# EAGLE design CoolRoof Terminal Module alimentation (EAGLE 9.5.2)
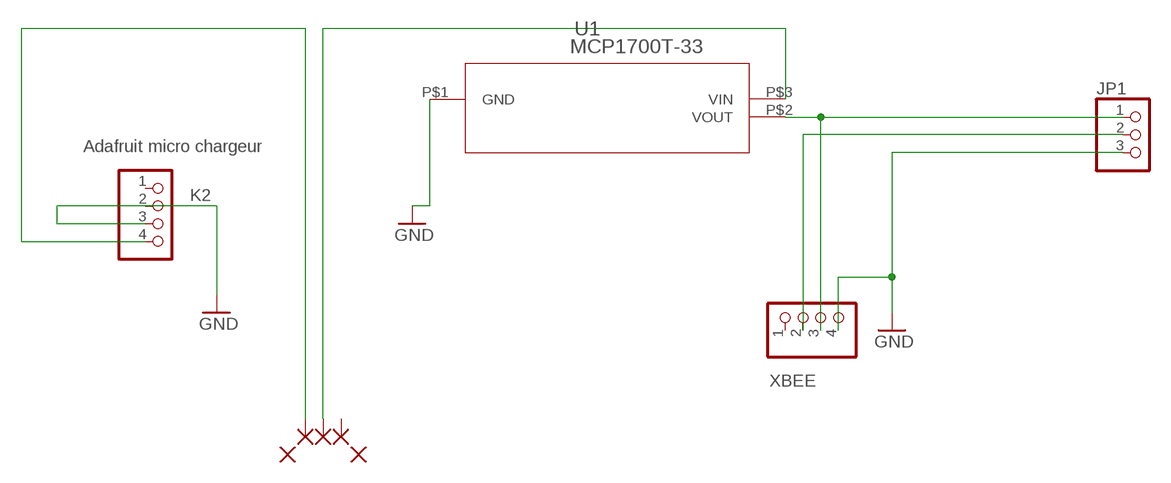
[diagram p0: schematic, sheet 1]

## Parts
JP1  PINHD-1X3  [1X03]
K2  Adafruit micro chargeur  PINHD-1X4  [1X04]
PAD1  1,6/0,8  [1,6/0,8]
PAD2  1,6/0,8  [1,6/0,8]
PAD3  1,6/0,8  [1,6/0,8]
PAD4  N_2,0/1,5  [2,0/1,5]
PAD5  N_2,0/1,5  [2,0/1,5]
U1  MCP1700T-33  MCP1700T-3302E/TTSOT-23  [SOT-23]
XBEE  PINHD-1X4  [1X04]

## Nets
GND: JP1.3 K2.2 K2.3 U1.P$1(GND) XBEE.4
N$1: JP1.1 U1.P$2(VOUT) XBEE.3
N$2: JP1.2 XBEE.2
N$3: K2.4 PAD1.1(P)
N$8: PAD2.1(P) U1.P$3(VIN)
Unconnected: K2.1 PAD3.1(P) XBEE.1

## Library data of the parts
JP1 = pinhead:PINHD-1X3: PIN HEADER
K2 = pinhead:PINHD-1X4: PIN HEADER
PAD1-PAD3 = _MCL_PADS:1,6/0,8
PAD4 PAD5 = _MCL_PADS:N_2,0/1,5
U1 = MCP1700T-3302E:MCP1700T-3302E/TT
XBEE = _MCL_pinhead:PINHD-1X4: PIN HEADER

## Net classes
0 default: width 0.508 mm, clearance 0.508 mm

## Board
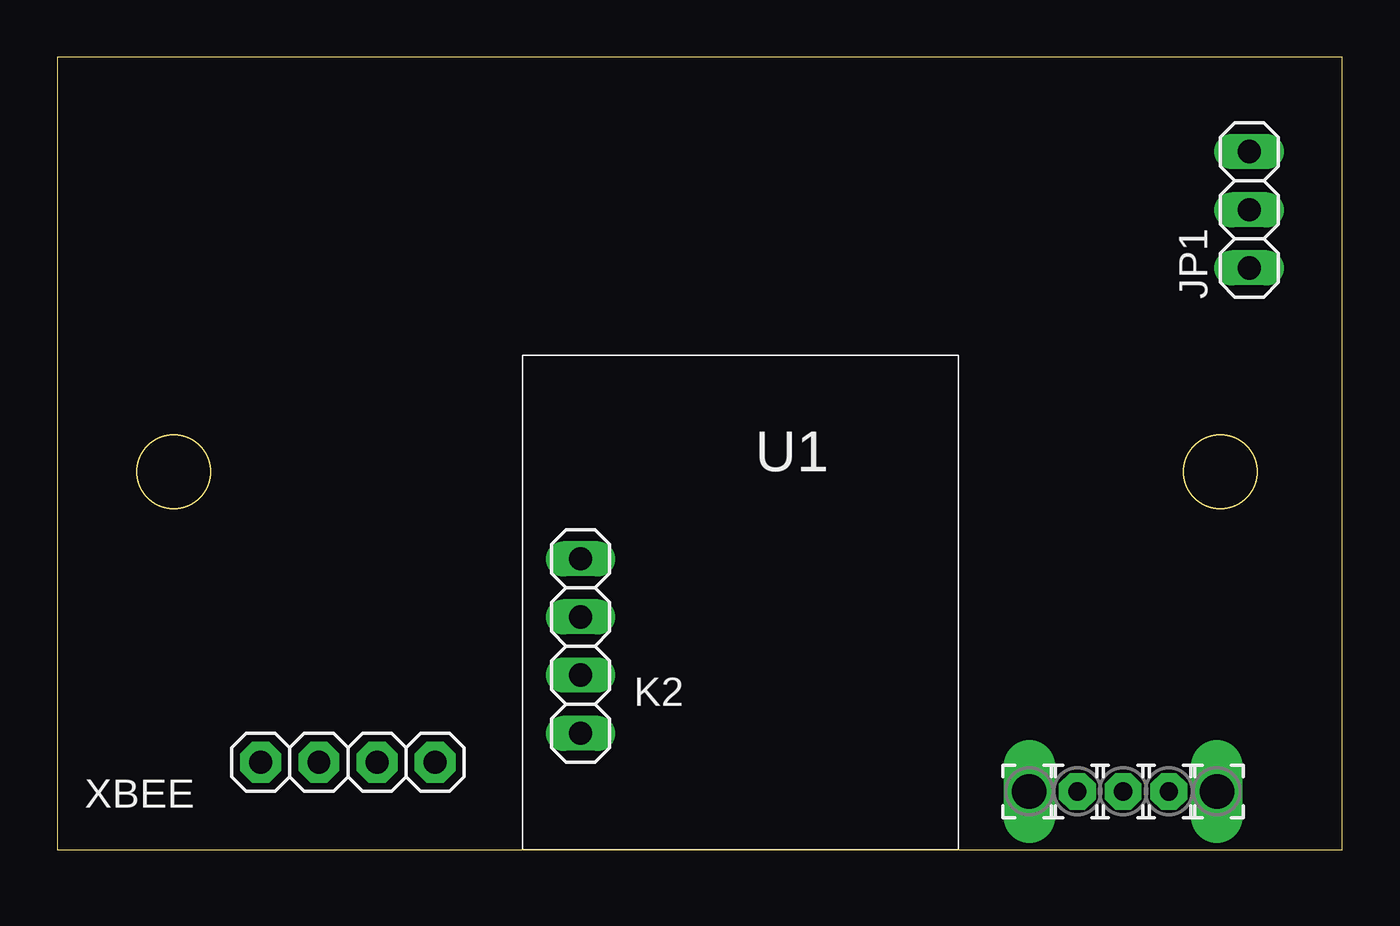
[diagram p1: board, top side]
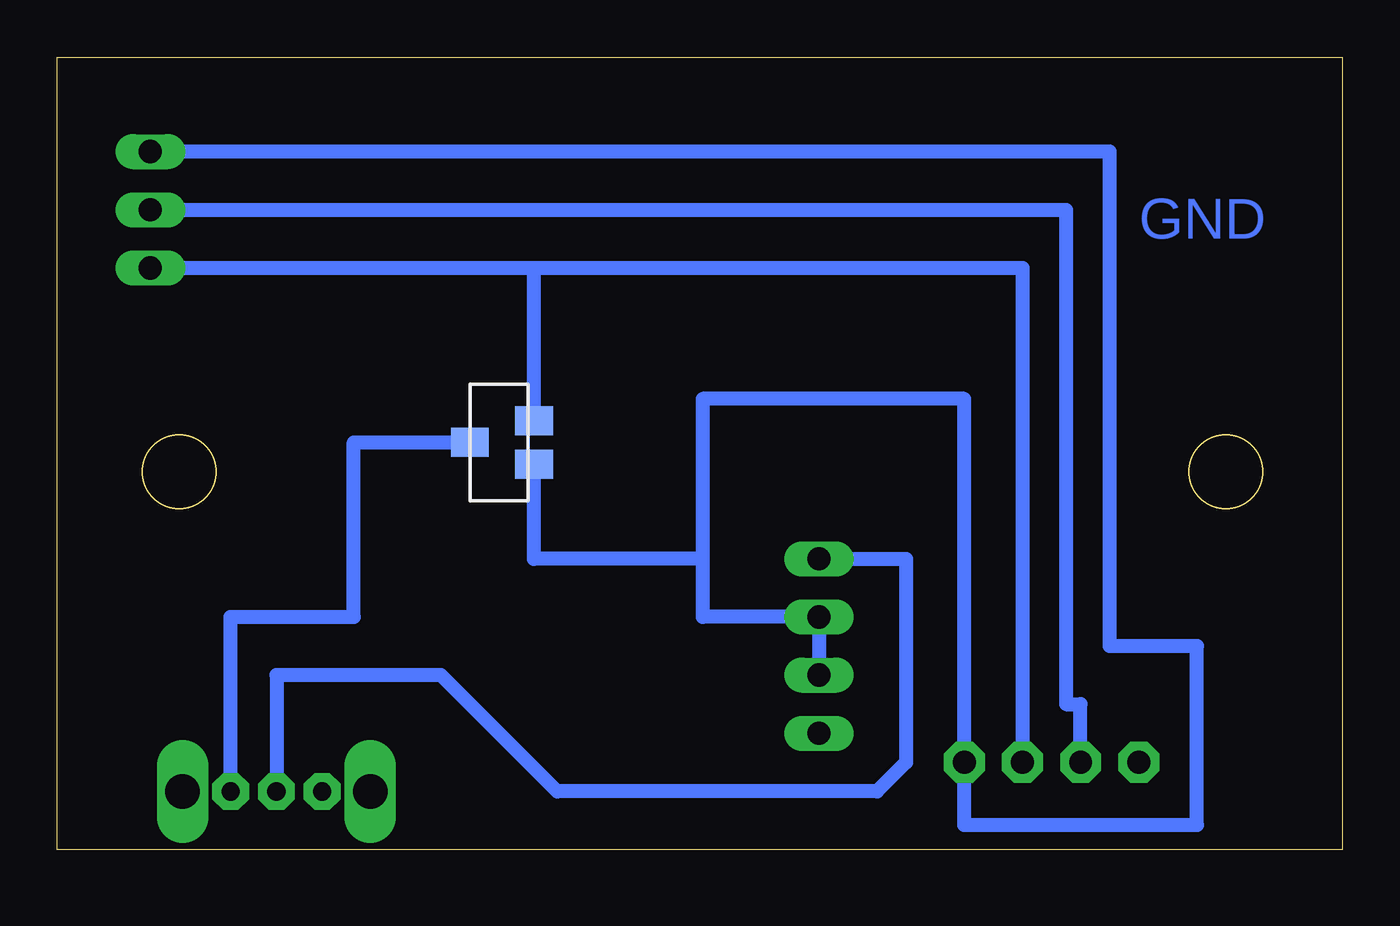
[diagram p2: board, bottom side, seen from below]

Size 56.13 x 34.6 mm. Coordinates in mm from the lower left corner, seen from the top.
Outline: 0,0 56.13,0 56.13,34.6 0,34.6 0,0
Outline: circle at 5.08,16.51 radius 1.6
Outline: circle at 50.8,16.51 radius 1.6
Copper layers (1*16): Top 0.035mm / dielectric 1.5mm / Bottom 0.035mm
Design rules "default": minimum track width 20mil, minimum drill 0.5mm, track to track 20mil, track to pad 20mil, pad to pad 20mil, via to via 20mil, smd to smd 20mil, copper to edge 30mil, drill to drill 20mil, minimum pad ring 10mil, minimum via ring 8mil, stop-mask expansion 4mil, vias tented up to drill 0mil, thermal gap 10mil

### Footprints (pad centres in the part's own frame; a part is rotated, then mirrored left to right if it is on the bottom)
1X03 = drill 1.016 long: 1 -2.54,0; 2 0,0; 3 2.54,0
1X04 = drill 1.016 long: 1 -3.81,0; 2 -1.27,0; 3 1.27,0; 4 3.81,0
1,6/0,8 = drill 0.8 pad 1.6 octagon: 1 0,0
2,0/1,5 = drill 1.5 pad 2 long: 1 0,0
SOT-23 = smd 1.27 x 1.651: P$1 -0.95,-0.254; P$2 0.95,-0.254; P$3 0,2.554
1X04' = drill 1 pad 1.778 octagon: 1 -3.81,0; 2 -1.27,0; 3 1.27,0; 4 3.81,0

### Placement (x,y rotation side)
JP1  52.07,27.94 90 top
K2  22.86,8.89 90 top
PAD1  46.56,2.54 0 top
PAD2  48.56,2.54 0 top
PAD3  44.56,2.54 0 top
PAD4  50.66,2.54 90 top
PAD5  42.46,2.54 90 top
U1  35.56,17.78 90 bottom
XBEE  [1X04']  12.7,3.81 0 top

### Tracks (layer width: path | path; a pad name or v marks a point on that pad's centre or on a via)
GND
  Bottom 0.61: K2.2 K2.3 27.94,10.16 27.94,12.7 | 27.94,12.7 35.31,12.7 U1.P$1 | JP1.3 10.16,30.48 10.16,8.89 6.35,8.89 6.35,1.07 16.51,1.07 XBEE.4 16.51,19.68 27.94,19.68 27.94,12.7
N$1
  Bottom 0.61: JP1.1 35.31,25.4 | U1.P$2 35.31,25.4 | 35.31,25.4 13.97,25.4 XBEE.3
N$2
  Bottom 0.61: XBEE.2 11.43,6.35 12.06,6.35 12.06,27.94 JP1.2
N$3
  Bottom 0.61: PAD1.1 46.56,7.62 39.37,7.62 34.29,2.54 20.32,2.54 19.05,3.81 19.05,12.7 K2.4
N$8
  Bottom 0.61: PAD2.1 48.56,10.16 43.18,10.16 43.18,17.78 U1.P$3

### Text on the board
Bottom: GND